# EAGLE design Themistor_Breakout (EAGLE 8.3.2)
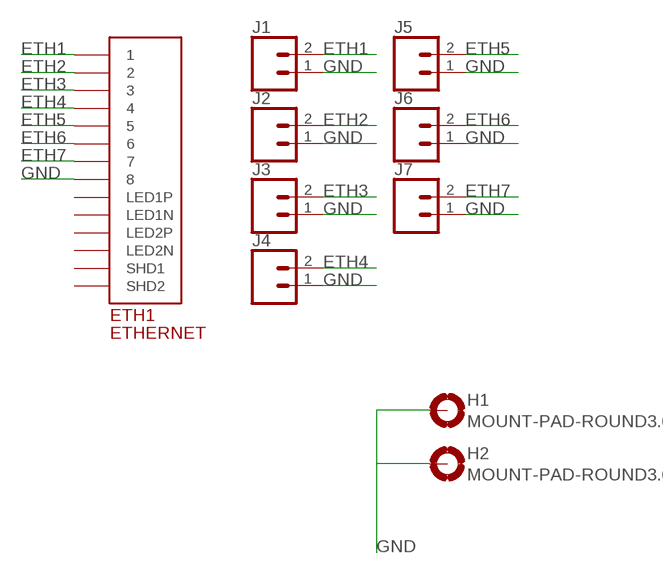
[diagram p0: schematic, sheet 1]

## Parts
ETH1  ETHERNET  [A122645-ND]
H1  MOUNT-PAD-ROUND3.6  [3,6-PAD]
H2  MOUNT-PAD-ROUND3.6  [3,6-PAD]
J1  CONN_023.5MM  [SCREWTERMINAL-3.5MM-2]
J2  CONN_023.5MM  [SCREWTERMINAL-3.5MM-2]
J3  CONN_023.5MM  [SCREWTERMINAL-3.5MM-2]
J4  CONN_023.5MM  [SCREWTERMINAL-3.5MM-2]
J5  CONN_023.5MM  [SCREWTERMINAL-3.5MM-2]
J6  CONN_023.5MM  [SCREWTERMINAL-3.5MM-2]
J7  CONN_023.5MM  [SCREWTERMINAL-3.5MM-2]

## Nets
ETH1: ETH1.P$1 J1.2
ETH2: ETH1.P$2 J2.2
ETH3: ETH1.P$3 J3.2
ETH4: ETH1.P$4 J4.2
ETH5: ETH1.P$5 J5.2
ETH6: ETH1.P$6 J6.2
ETH7: ETH1.P$7 J7.2
GND: ETH1.P$8 H1.B3,6(MOUNT) H2.B3,6(MOUNT) J1.1 J2.1 J3.1 J4.1 J5.1 J6.1 J7.1
Unconnected: ETH1.P$9(LED1N) ETH1.P$10(LED1P) ETH1.P$11(LED2N) ETH1.P$12(LED2P) ETH1.P$13(SHD1) ETH1.P$14(SHD2)

## Library data of the parts
ETH1 = ETHERNET:ETHERNET: Ethernet port with 2 leds. digikey number A122645-ND
H1 H2 = holes:MOUNT-PAD-ROUND: MOUNTING PAD, round
J1-J7 = SparkFun-Connectors:CONN_02: Multi connection point. Often used as Generic Header-pin footprint for 0.1 inch spaced/style header connections On any of the 0.1 inch spaced packages, you can populate with these: Break Away Headers - Straight <https://www.sparkfun.com/products/116> (PRT-00116) Break Away Male Headers - Right Angle <https://www.sparkfun.com/products/553> (PRT-00553) Female Headers <https://www.sparkfun.com/products/115> (PRT-00115) Break Away Headers - Machine Pin <https://www.sparkfun.com/products/117> (PRT-00117) Break Away Female Headers - Swiss Machine Pin <https://www.sparkfun.com/products/743> (PRT-00743) For SCREWTERMINALS and SPRING TERMINALS visit here: Screw Terimnals on SparkFun.com <https://www.sparkfun.com/search/results?term=Screw+Terminals> (5mm/3.5mm/2.54mm spacing) This device is also useful as a general connection point to wire up your design to another part of your project. Our various solder wires solder well into these plated through hole pads. Hook-Up Wire - Assortment (Stranded, 22 AWG) <https://www.sparkfun.com/products/11375> (PRT-11375) Hook-Up Wire - Assortment (Solid Core, 22 AWG) <https://www.sparkfun.com/products/11367> (PRT-11367) View the entire wire category on our website here <https://www.sparkfun.com/categories/141> Special notes: Molex polarized connector foot print use with: PRT-08233 with associated crimp pins and housings. 2.54_SCREWTERM for use with PRT-10571. 3.5mm Screw Terminal footprints for PRT-08084 5mm Screw Terminal footprints for use with PRT-08432; PROD_ID: CONN-08399

## Board
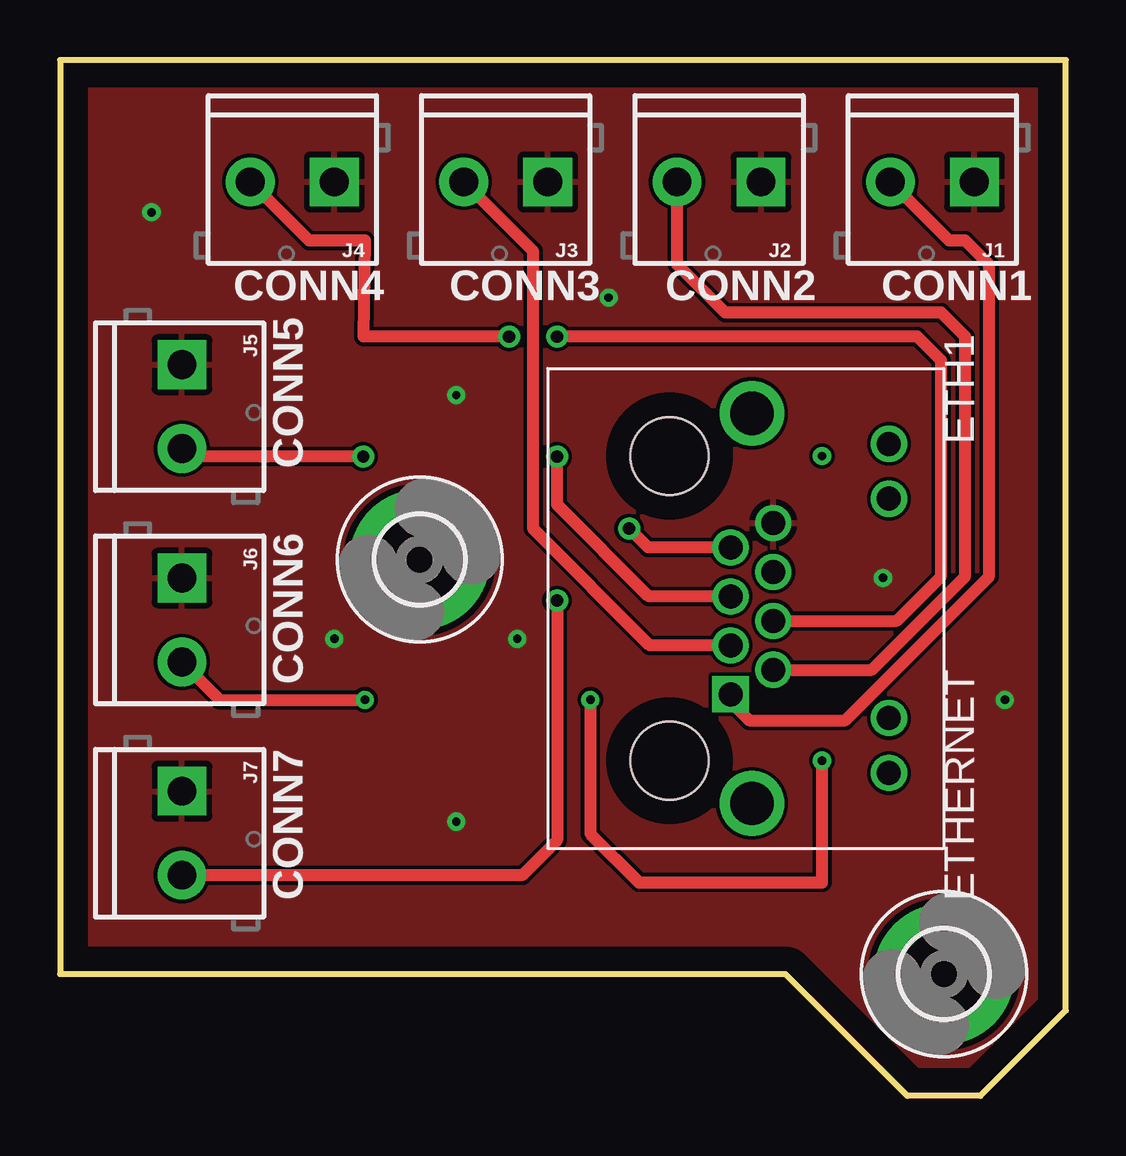
[diagram p1: board, top side]
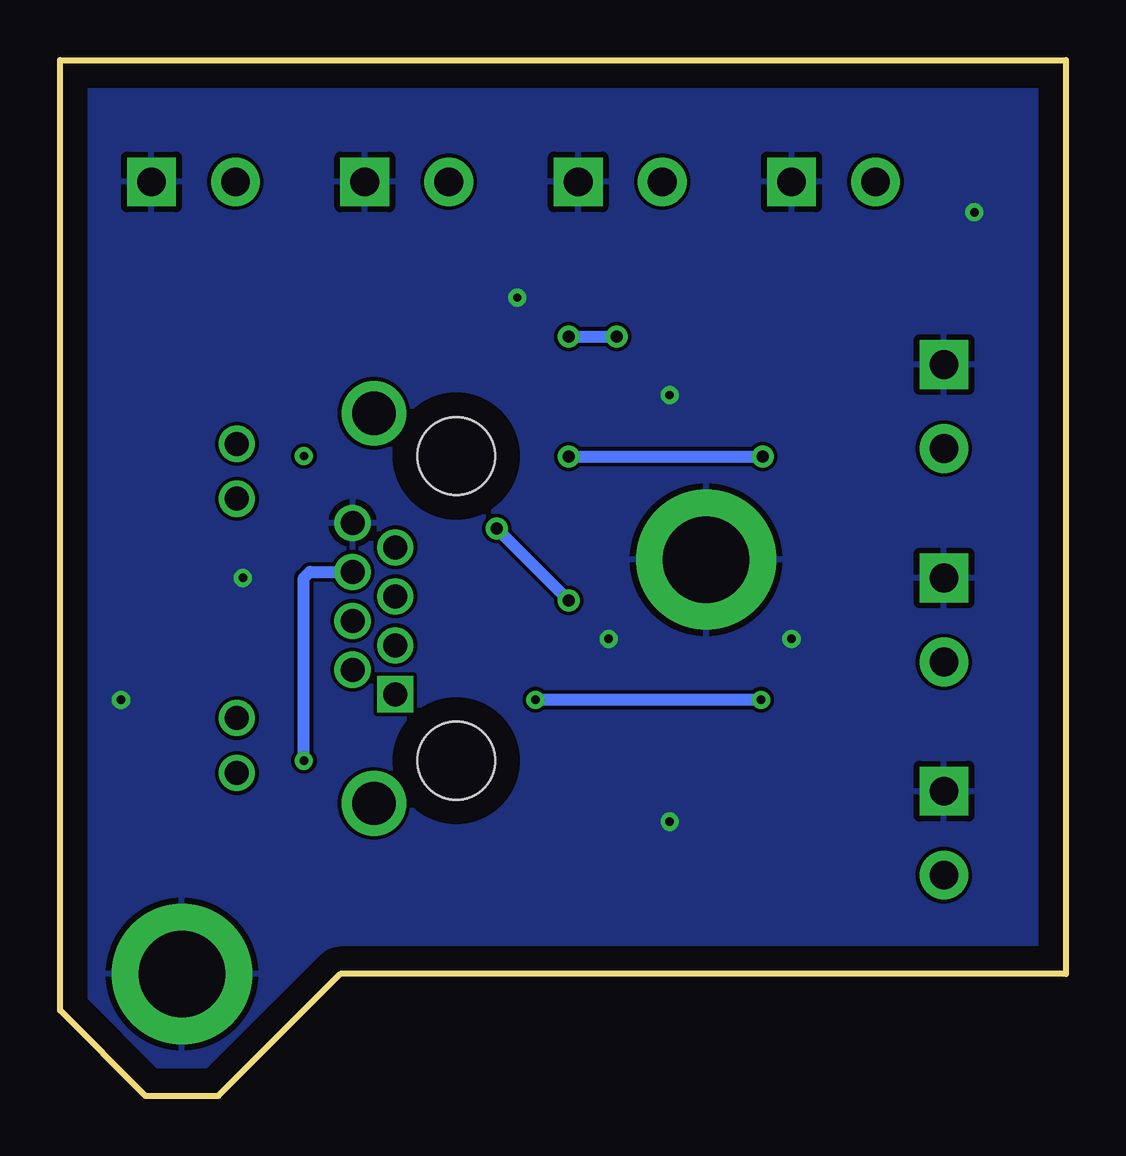
[diagram p2: board, bottom side, seen from below]

Size 41.91 x 43.18 mm. Coordinates in mm from the lower left corner, seen from the top.
Outline: 0,43.18 0,5.08 30.23,5.08 35.31,0 38.35,0 41.91,3.56 41.91,43.18 0,43.18
Copper layers (1*16): Top 0.035mm / dielectric 1.5mm / Bottom 0.035mm
Design rules "default": minimum track width 6mil, minimum drill 0.35mm, track to track 6mil, track to pad 6mil, pad to pad 6mil, via to via 6mil, smd to smd 6mil, copper to edge 40mil, drill to drill 6mil, minimum pad ring 10mil, minimum via ring 8mil, stop-mask expansion 4mil, vias tented up to drill 0mil, thermal gap 10mil

### Footprints (pad centres in the part's own frame; a part is rotated, then mirrored left to right if it is on the bottom)
A122645-ND = drill 1 square: P$1 3.58,2.54 | drill 1: P$2 2.56,4.32; P$3 1.54,2.54; P$4 0.52,4.32; P$5 -0.5,2.54; P$6 -1.52,4.32; P$7 -2.54,2.54; P$8 -3.56,4.32; P$9 -6.86,9.14; P$10 -4.57,9.14; P$11 4.57,9.14; P$12 6.86,9.14 | drill 1.8: P$13 -8.13,3.43; P$14 8.13,3.43 | hole 3.25: -6.35,0; 6.35,0
3,6-PAD = drill 3.6 pad 5.842: B3,6 0,0
SCREWTERMINAL-3.5MM-2 = drill 1.2 pad 2.032 square: 1 0,0 | drill 1.2 pad 2.032: 2 3.5,0

### Placement (x,y rotation side)
ETH1  25.4,20.32 270 top
H1  36.83,5.08 0 top
H2  14.99,22.35 0 top
J1  38.1,38.1 180 top
J2  29.21,38.1 180 top
J3  20.32,38.1 180 top
J4  11.43,38.1 180 top
J5  5.08,30.48 270 top
J6  5.08,21.59 270 top
J7  5.08,12.7 270 top

### Tracks (layer width: path | path; a pad name or v marks a point on that pad's centre or on a via)
ETH1
  Top 0.508: ETH1.P$1 27.94,16.42 28.71,15.65 32.71,15.65 38.71,21.65 38.71,34.65 37.71,35.65 37.05,35.65 J1.2
ETH2
  Top 0.508: ETH1.P$2 33.82,17.76 37.71,21.65 37.71,31.65 36.71,32.65 27.71,32.65 25.71,34.65 J2.2
ETH3
  Top 0.508: ETH1.P$3 24.58,18.78 19.71,23.65 19.71,35.21 J3.2
ETH4  (via drill 0.51)
  Top 0.508: ETH1.P$4 34.86,19.8 36.71,21.65 36.71,30.65 35.71,31.65 v20.71,31.65 | v18.71,31.65 12.65,31.65 12.71,35.65 10.38,35.65 J4.2
  Bottom 0.152: 29.87,19.86 ETH1.P$4
  Bottom 0.508: v20.71,31.65 v18.71,31.65
ETH5  (via drill 0.51)
  Top 0.508: ETH1.P$5 24.54,20.82 20.71,24.65 v20.71,26.65 | v12.63,26.65 5.41,26.65 J5.2
  Bottom 0.508: v20.71,26.65 v12.63,26.65
ETH6  (via drill 0.35)
  Top 0.508: J6.2 6.66,16.51 v12.7,16.51 | v22.1,16.51 22.1,10.92 24.13,8.89 31.75,8.89 v31.75,13.97
  Bottom 0.508: v12.7,16.51 v22.1,16.51 | v31.75,13.97 31.75,21.59 31.5,21.84 ETH1.P$6
ETH7  (via drill 0.51)
  Top 0.508: ETH1.P$7 24.5,22.86 v23.71,23.65 | v20.71,20.65 20.71,10.65 19.26,9.2 J7.2
  Bottom 0.508: v23.71,23.65 v20.71,20.65
GND  (via drill 0.35)
  other vias: 22.86,33.27 3.81,36.83 34.29,21.59 16.51,11.43 19.05,19.05 11.43,19.05 39.37,16.51 16.51,29.21
  pour Top: -1.27,44.45 -1.27,3.81 29.21,3.81 34.29,-1.27 39.37,-1.27 43.43,2.79 43.43,42.93 41.91,44.45
  pour Bottom: -1.27,3.81 29.21,3.81 34.29,-1.27 39.12,-1.27 43.18,2.79 43.18,43.18 41.91,44.45 0,44.45 -1.27,43.18
N$10  (via drill 0.35)
  other vias: 31.75,26.67

### Text on the board
tPlace: CONN4 | CONN3 | CONN2 | CONN1 | CONN5 | CONN6 | CONN7